# Altium project STM32F4_Mixed-Signal_Interface_Board.PrjPcb
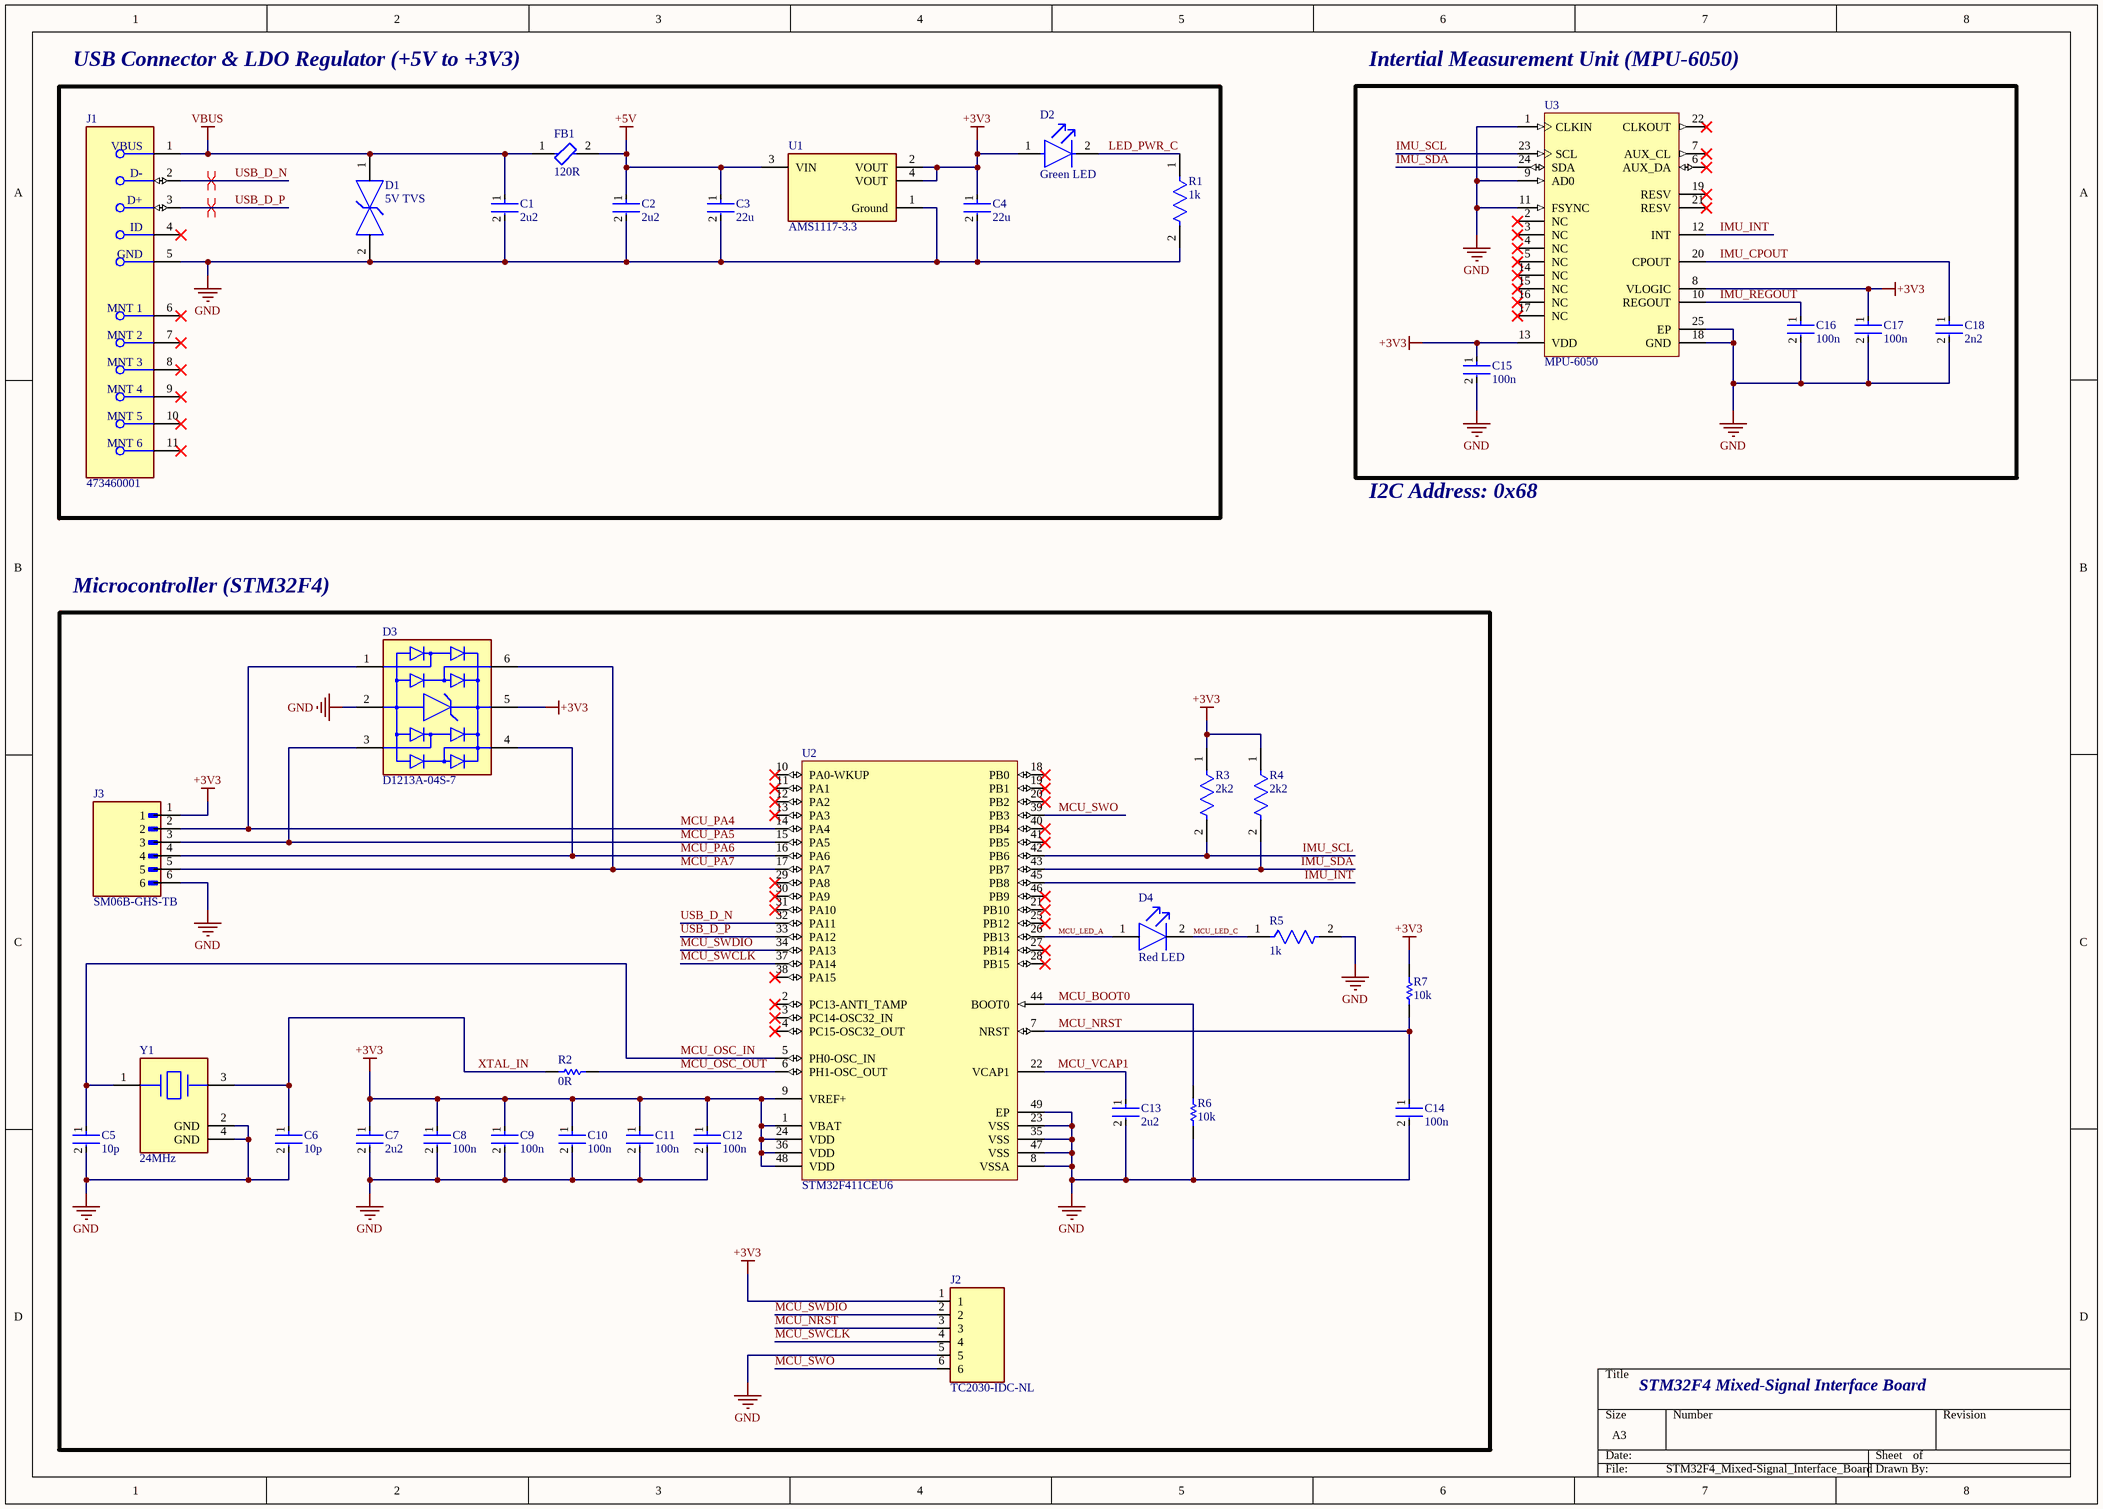
[diagram p0: STM32F4_Mixed-Signal_Interface_Board.SchDoc]
1 sheet, 37 parts. Net scope: global (net labels, ports and power ports of the same name join across sheets).
Board file: STM32F4_Mixed-Signal_Interface_Board_PCB.PcbDoc

## Sheet STM32F4_Mixed-Signal_Interface_Board.SchDoc
size A3; SheetNumber: 1; SheetTotal: 1

### Parts
C1  2u2  [FP-CC0603-DA-MFG]
C2  2u2  [FP-CC0603-DA-MFG]
C3  22u  [FP-0805-L_2_0_0_2-W_1_25-IPC_A]
C4  22u  [FP-0805-L_2_0_0_2-W_1_25-IPC_A]
C5  10p  [FP-C0402-BB-MFG]
C6  10p  [FP-C0402-BB-MFG]
C7  2u2  [FP-CC0603-DA-MFG]
C8  100n  [FP-C0402-BB-MFG]
C9  100n  [FP-C0402-BB-MFG]
C10  100n  [FP-C0402-BB-MFG]
C11  100n  [FP-C0402-BB-MFG]
C12  100n  [FP-C0402-BB-MFG]
C13  2u2  [FP-CC0603-DA-MFG]
C14  100n  [FP-C0402-BB-MFG]
C15  100n  [FP-C0402-BB-MFG]
C16  100n  [FP-C0402-BB-MFG]
C17  100n  [FP-C0402-BB-MFG]
C18  2n2  [FP-C0402-BB-MFG]
D1  5V TVS  [FP-GG0402-MFG]
D2  Green LED  [FP-SM0402GC-MFG]
D3  D1213A-04S-7  [FP-SOT363-MFG]
D4  Red LED  [FP-SM0402RC-MFG]
FB1  120R  [FP-MMZ0603-IPC_A]
J1  473460001  [FP-473460001-MFG]
J2  TC2030-IDC-NL  [TAG_TC2030-IDC-NL]
J3  SM06B-GHS-TB  [JST_SM06B-GHS-TB]
R1  1k  [FP-MCS0402-IPC_C]
R2  0R  [RESC1005X40X20NL05T10]
R3  2k2  [FP-RT0402-MFG]
R4  2k2  [FP-RT0402-MFG]
R5  1k  [FP-MCS0402-IPC_C]
R6  10k  [RESC1005X40X20NL05T10]
R7  10k  [RESC1005X40X20NL05T10]
U1  AMS1117-3.3  [FP-AMS1117-IPC_C]
U2  STM32F411CEU6  [STM-UFQFPN48_L]
U3  MPU-6050  [IS-QFN-24_V]
Y1  24MHz  [FP-ABM11W-MFG]

### Blocks framed on the sheet
USB Connector & LDO Regulator (+5V to +3V3): C1-C4 D1 D2 FB1 J1 R1 U1
Intertial Measurement Unit (MPU-6050): C15-C18 U3
Microcontroller (STM32F4): C5-C14 D3 D4 J2 J3 R2-R7 U2 Y1

### Nets
+3V3: C4.1 C7.1 C8.1 C9.1 C10.1 C11.1 C12.1 C15.1 C17.1 D2.1(A) D3.5(VP) J2.1 J3.1 R3.1 R4.1 R7.2 U1.2(VOUT) U1.4(VOUT) U2.1(VBAT) U2.9(VREF+) U2.24(VDD) U2.36(VDD) U2.48(VDD) U3.8(VLOGIC) U3.13(VDD)
+5V: C2.1 C3.1 FB1.2 U1.3(VIN)
GND: C1.2 C2.2 C3.2 C4.2 C5.2 C6.2 C7.2 C8.2 C9.2 C10.2 C11.2 C12.2 C13.2 C14.2 C15.2 C16.2 C17.2 C18.2 D1.2(IO_2) D3.2(VN) J1.5(GND) J2.5 J3.6 R1.2 R5.2 R6.1 U1.1(Ground) U2.8(VSSA) U2.23(VSS) U2.35(VSS) U2.47(VSS) U2.49(EP) U3.1(CLKIN) U3.9(AD0) U3.11(FSYNC) U3.18(GND) U3.25(EP) Y1.2(GND) Y1.4(GND)
VBUS: C1.1 D1.1(IO_1) FB1.1 J1.1(VBUS)
IMU_CPOUT: C18.1 U3.20(CPOUT)
IMU_INT: U2.45(PB8) U3.12(INT)
IMU_REGOUT: C16.1 U3.10(REGOUT)
IMU_SCL: R3.2 U2.42(PB6) U3.23(SCL)
IMU_SDA: R4.2 U2.43(PB7) U3.24(SDA)
LED_PWR_C: D2.2(C) R1.1
MCU_BOOT0: R6.2 U2.44(BOOT0)
MCU_LED_A: D4.1(A) U2.26(PB13)
MCU_LED_C: D4.2(C) R5.1
MCU_NRST: C14.1 J2.3 R7.1 U2.7(NRST)
MCU_OSC_IN: C5.1 U2.5(PH0-OSC_IN) Y1.1
MCU_OSC_OUT: R2.1 U2.6(PH1-OSC_OUT)
MCU_PA4: D3.1(CH1) J3.2 U2.14(PA4)
MCU_PA5: D3.3(CH2) J3.3 U2.15(PA5)
MCU_PA6: D3.4(CH3) J3.4 U2.16(PA6)
MCU_PA7: D3.6(CH4) J3.5 U2.17(PA7)
MCU_SWCLK: J2.4 U2.37(PA14)
MCU_SWDIO: J2.2 U2.34(PA13)
MCU_SWO: J2.6 U2.39(PB3)
MCU_VCAP1: C13.1 U2.22(VCAP1)
USB_D_N: J1.2(D-) U2.32(PA11)
USB_D_P: J1.3(D+) U2.33(PA12)
XTAL_IN: C6.1 R2.2 Y1.3

Not connected (* = marked no-connect by the designer): J1 4(ID)* 6(MNT_1)* 7(MNT_2)* 8(MNT_3)* 9(MNT_4)* 10(MNT_5)* 11(MNT_6)*; U2 2(PC13-ANTI_TAMP)* 3(PC14-OSC32_IN)* 4(PC15-OSC32_OUT)* 10(PA0-WKUP)* 11(PA1)* 12(PA2)* 13(PA3)* 18(PB0)* 19(PB1)* 20(PB2)* 21(PB10)* 25(PB12)* 27(PB14)* 28(PB15)* 29(PA8)* 30(PA9)* 31(PA10)* 38(PA15)* 40(PB4)* 41(PB5)* 46(PB9)*; U3 2(NC)* 3(NC)* 4(NC)* 5(NC)* 6(AUX_DA)* 7(AUX_CL)* 14(NC)* 15(NC)* 16(NC)* 17(NC)* 19(RESV)* 21(RESV)* 22(CLKOUT)*

### Layout directives
differential pair; net class DIFF_USB: USB_D_N, USB_D_P

### Notes on the sheet
- I2C Address: 0x68
- STM32F4 Mixed-Signal Interface Board

### Library data of the parts
C1 C2 C7 C13 = CMP-03422-000257-1: CAP CER 2.2UF 16V X5R 0603; Manufacturer Part Number: CC0603MRX5R7BB225; Manufacturer: YAGEO; Tolerance: 0.2; Temperature Coefficient: 15%; Material: Ceramic; Mouser Description: Multilayer Ceramic Capacitors MLCC - SMD/SMT 2.2uF 16V 20% Ceramic Capacitor; Temperature Range Low: -55°C; Lead Free: Yes; Device Class L1: Passive Components; Device Class L2: Capacitors; Temperature Characteristic: X5R; Height: 0.9mm; Digikey Description: CAP CER 2.2UF 16V X5R 0603; Package: CC0603-DA; RoHS: TRUE; Capacitance: 2.2 uF; Automotive: No; Value: 2.2 uF; Device Class L3: Ceramic Capacitors; Voltage: 16 V; ComponentLink2URL: http://www.yageo.com/documents/recent/UPY-GPHC_X7R_6.3V-to-50V_18.pdf; Footprint Url: http://www.yageo.com/exep/pages/download/literatures/UPY-C_GEN_24.pdf; Octopart: https://octopart.com/cc0603mrx5r7bb225-yageo-81932636; Temperature Range High: +125°C; Temperature: -55°C to +125°C; Category: Cap; Voltage Rating: 16 V; ComponentLink2Description: Datasheet
C3 C4 = CMP-14477-000140-3: Multilayer Ceramic Capacitor 22uF 16V X5R 20% SMD 0805 T/R; Resistor Type: Ceramic; Packaging: Tape and Reel; Height: 1.25mm; RoHS Compliant: Yes; Case Code (Metric): 2012; Series: M; Dielectric: X5R; Max Operating Temperature: 85°C; Voltage Rating: 16V; Width: 0.039inch; Capacitance: 22uF; Min Operating Temperature: -55°C; Thickness: 0.049inch; Termination: SMD/SMT; Construction: Flat; Voltage Rating (DC): 16V; Package Quantity: 1; Tolerance: 20%; Case Code (Imperial): 0805; Length: 2mm; Mount: Surface Mount; Halogen Free: Halogen Free; Case/Package: 0805
C5 C6 = CMP-03020-017648-1: C0402 10 pF X8R 1.00% 16 V; Manufacturer Part Number: C0402C100F4HACAUTO; Manufacturer: Kemet; Material: Ceramic; Capacitance: 10 pF; Tolerance: 0.01; Voltage Rating: 16 V; Temperature Coefficient: 15%; Value: 10 pF; ComponentLink2URL: https://content.kemet.com/datasheets/KEM_C1002_X7R_SMD.pdf; Lead Free: Yes; Temperature: -55°C to +125°C; ComponentLink2Description: Datasheet; Temperature Range Low: -55°C; Package: C0402-BB; Device Class L3: Ceramic Capacitors; Ipc Land Pattern Name: CAPC10050X50; RoHS: TRUE; Category: Cap; Device Class L1: Passive Components; Device Class L2: Capacitors; Automotive: No; Height: 0.55mm; Temperature Range High: +125°C; Temperature Characteristic: X8R; Octopart: https://octopart.com/c0402c100f4hacauto-kemet-88079165
C8-C12 C14-C18 = CMP-2008-03082-2: CAP CER 0.1UF 16V X7R 0402; Manufacturer Part Number: C0402C104K4RACAUTO; Manufacturer: Kemet; Temperature Coefficient: 15%; Tolerance: 0.1; Capacitance: 0.10 μF; Material: Ceramic; Value: 0.10 μF; Device Class L3: Ceramic Capacitors; Voltage Rating: 16 V; Temperature Range High: +125°C; Device Class L2: Capacitors; Height: 0.55mm; Category: Cap; RoHS: TRUE; Temperature Characteristic: X7R; Octopart: https://octopart.com/c0402c104k4racauto-kemet-17309149; Digikey Description: CAP CER 0.1UF 16V X7R 0402; Device Class L1: Passive Components; Temperature Range Low: -55°C; Mouser Description: Cap Ceramic 0.1uF 16V X7R 10% Pad SMD 0402 125C Automotive T/R; ComponentLink2Description: Datasheet; Automotive: No; Ipc Land Pattern Name: CAPC10050X50; ComponentLink2URL: https://content.kemet.com/datasheets/KEM_C1002_X7R_SMD.pdf; Lead Free: Yes; Temperature: -55°C to +125°C; Package: C0402-BB
D1 = CMP-04587-000001-1: TVS DIODE 5V 12V 0402; Manufacturer Part Number: GG040205100N2P; Manufacturer: AVX Corporation; Number Of Channels: 1; Peak Pulse Current: 16A; Capacitance: 10pF; Direction: Bidirectional; Value: 10pF; Breakdown Voltage: 5.5V; Peak Pulse Power: 96W; Automotive: No; ComponentLink2URL: http://datasheets.avx.com/AVX-GiGuard.pdf; Lead Free: Yes; Device Class L2: TVS Diodes; Temperature: -55°C to +125°C; Category: Diode; Reverse Standoff Voltage: 5V; Octopart: https://octopart.com/gg040205100n2p-avx-81066081; Clamping Voltage: 12V; Ipc Land Pattern Name: DIOC10060X50; Digikey Description: TVS DIODE 5V 12V 0402; Device Class L3: unset; ComponentLink2Description: Datasheet; Temperature Range Low: -55°C; Temperature Range High: +125°C; Device Class L1: Circuit Protection; Height: 0.55mm; Package: GG0402; RoHS: TRUE
D2 = CMP-35283-000001-2: LED GREEN CLEAR 0402 SMD; Lens Size: 1mm; Luminous Intensity: 28.5mcd; Viewing Angle: 130°; Forward Voltage: 1.9V; Test Current: 20mA; Lens Color: Colorless; Lens Style: Flat; Dominant Wavelength: 572nm; Case Code (Metric): 1005; Mount: Surface Mount; Case Code (Imperial): 0402; Length: 1mm; Width: 0.5mm; Case/Package: 0402; Lens Transparency: Clear; Height: 0.71mm; Packaging: Tape and Reel; Color: Green
D3 = CMP-12828-000023-1: TVS DIODE 3.3V 10V SOT363; Min Breakdown Voltage: 6V; ESD Protection: Yes; Direction: Unidirectional; Number of Channels: 4; Capacitance: 1.2pF; Test Current: 1mA; Max Reverse Leakage Current: 1uA; Max Surge Current: 5A; Peak Pulse Current: 1A; Max Power Dissipation: 200mW; Width: 1.35mm; Height: 1mm; Package Quantity: 3000; Lead Free: Lead Free; Max Operating Temperature: 150°C; Termination: SMD/SMT; Case/Package: SOT-363; Clamping Voltage: 10V; Length: 2.15mm; Power Line Protection: Yes; Number of Pins: 6; Polarity: Unidirectional; Packaging: Tape and Reel; Contact Plating: Tin; Number of Bidirectional Channels: 4; Breakdown Voltage: 6V; Leakage Current: 1uA; Working Voltage: 3.3V; REACH SVHC: No SVHC; Reverse Standoff Voltage: 3.3V; Mount: Surface Mount; Depth: 1.3mm; Radiation Hardening: No; Min Operating Temperature: -55°C
D4 = CMP-35283-000003-1: LED RED CLEAR 0402 SMD; Test Current: 20mA; Luminous Intensity: 90mcd; Lens Color: Colorless; Lens Style: Flat; Lens Size: 1mm; Forward Voltage: 2.1V; Viewing Angle: 130°; Dominant Wavelength: 631nm; Width: 0.5mm; Length: 1mm; Packaging: Tape and Reel; Height: 0.71mm; Lens Transparency: Clear; Case Code (Imperial): 0402; Case/Package: 0402; Mount: Surface Mount; Case Code (Metric): 1005; Color: Red
FB1 = CMP-08257-000058-1: Signal Line Ferrite Bead 120Ω @ 100MHz 480mA DCR 220mΩ SMD 0201; DC Resistance (DCR): 220mR; Tolerance: 25%; Number of Lines: 1; Case Code (Metric): 0603; Termination: SMD/SMT; Case/Package: 0201; Max Current Rating: 480mA; Max DC Current: 480mA; Max Operating Temperature: 125°C; Weight: 6E-06oz; Impedance: 120R; Height: 0.013inch; Length: 0.024inch; Package Quantity: 15000; RoHS Compliant: Yes; Case Code (Imperial): 0201; Width: 0.012inch; Mount: Surface Mount; Packaging: Tape and Reel; Min Operating Temperature: -55°C
J1 = CMP-2000-05246-2: CONN RCPT USB2.0 MICRO B SMD R/A; Manufacturer: Molex; Conn Orientation: Right Angle; Is Female: yes; Shielding: true; Pitch: 0.65mm; Number Of Contacts: 5; Voltage Rating: 30V; Current Rating: 1.8A; Device Class L2: USB Connectors; Digikey Description: CONN RCPT USB2.0 MICRO B SMD R/A; Height: 2.945mm; RoHS: TRUE; ComponentLink2Description: Datasheet; Octopart: https://octopart.com/47346-0001-molex-7164928; Automotive: No; Package: 0; Category: Conn; Device Class L1: Connectors; Usb Standard: USB 2.0; Temperature: -30°C to +85°C; Temperature Range Low: -30°C; Footprint Url: https://www.molex.com/pdm_docs/sd/473460001_sd.pdf; ComponentLink2URL: https://www.molex.com/webdocs/datasheets/pdf/en-us/0473460001_IO_CONNECTORS.pdf; Lead Free: Yes; Manufacturer Part Number: 473460001; Contact Material: Gold,Nickel; Temperature Range High: +85°C; Device Class L3: unset
J2 = CMP-003-000000-1: CABLE ADAPTER 6 POS; Value: *; Component Type: Standard; Package: None; Source: TC2030-IDC-NL.SchLib; Pin Count: 6; Availability: Unavailable; Price: None; MP: TC2030-IDC-NL; Design Item ID: TC2030-IDC-NL
J3 = CMP-002-00071-1: Connector Header Surface Mount, Right Angle 6 position 0.049 (1.25mm); MF: JST Sales; SnapEDA_Link: https://www.snapeda.com/parts/SM06B-GHS-TB/JST/view-part/?ref=snap; Pins: 6; Design Item ID: SM06B-GHS-TB; Check_prices: https://www.snapeda.com/parts/SM06B-GHS-TB/JST/view-part/?ref=eda; Source: SM06B-GHS-TB.SchLib; Case/Package: None; Value: *; Component Type: Standard; MP: SM06B-GHS-TB
R1 R5 = CMP-2002-02445-2: RES SMD 1.2K OHM 1% 1/10W 0402; Resistance: 1kR; Tolerance: 0.1%; Max Power Dissipation: 63mW; Temperature Coefficient: 25ppm/°C; Max Operating Temperature: 125°C; Min Operating Temperature: -55°C; Case/Package: 0402; Packaging: Tape and Reel; Width: 0.02inch; Lead Free: Lead Free; Number of Terminations: 2; Height: 0.015inch; Package Quantity: 10000; Length: 0.039inch; Composition: Thin Film; Contact Plating: Tin; Depth: 0.5mm; Military Standard: Not
R2 R6 R7 = CMP-2002-01682-1: Manufacturer: Vishay BCcomponents; Part Number: TNPW040210K0DEED
R3 R4 = CMP-03412-027179-1: RES SMD 2.2K OHM 0.1% 1/16W 0402; Manufacturer Part Number: RT0402BRB072K2L; Manufacturer: Yageo; Resistance: 2.2KΩ; Temperature Coefficient: 10 ppm/°C; Value: 2.2KΩ; Tolerance: 0.001; Voltage Rating: 50V; Power Rating: 0.063W; Device Class L1: Passive Components; Composition: Thin Film; Automotive: No; Device Class L3: Chip SMD Resistors; Package: RT0402; Temperature: -55°C to +155°C; ComponentLink2Description: Datasheet; Ipc Land Pattern Name: RESC10050X30; Category: Res; ComponentLink2URL: http://www.yageo.com/documents/recent/PYu-RT_1-to-0.01_RoHS_L_9.pdf; Series: RT; Device Class L2: Resistors; Footprint Url: http://www.yageo.com/exep/pages/download/literatures/PYu-R_Mount_10.pdf; Lead Free: Yes; Octopart: https://octopart.com/rt0402brb072k2l-yageo-71392561; Temperature Range Low: -55°C; RoHS: TRUE; Height: 0.35mm; Digikey Description: RES SMD 2.2K OHM 0.1% 1/16W 0402; Temperature Range High: +155°C
U1 = CMP-209535-000001-1: LDO Voltage Regulators 1A, 3.3V; Manufacturer: Advanced Monolithic Systems; Dropout Voltage: 1.1V; Output Type: Fixed; Nominal Supply Current: 5mA; Max Power Dissipation: 1.2W; Max Supply Voltage: 15V; Number Of Outputs: 1; Standoff Height: 0.64mm; Max Junction Temp: +125°C; Height: 1.8mm; Package: AMS1117; Device Class L2: Power Management ICs; ComponentLink2Description: Datasheet; ComponentLink2URL: http://www.advanced-monolithic.com/pdf/ds1117.pdf; Category: IC; RoHS: TRUE; Automotive: No; Device Class L1: Integrated Circuits (ICs); Output Current: 1A; Device Class L3: Voltage Regulators - Linear; Temperature: -40°C to +125°C; Output Voltage: 3.3V; Manufacturer Part Number: AMS1117-3.3; Temperature Range Low: -40°C; Octopart: https://octopart.com/ams1117-3.3-advanced+monolithic+systems-25899300; Lead Free: Yes; Ipc Land Pattern Name: SOT229P700X180-4; Temperature Range High: +125°C
U2 = CMP-0243-00165-1: ARM Cortex-M4 32-bit MCU+FPU, 512 KB Flash, 128 KB RAM, 36 I/Os, 48-Pin UFQFPN, -40 to 85 degC, Tray; Operating Frequency(F) (Processor speed) (MHz): 100; FLASH Size (Prog) (kB): 512; Internal RAM Size (kB): 128; I/Os (High Current): 36; Supply Voltage(Vcc) min (V): 1.7; Package Reference: 48-Pin Ultra Thin Fine Pitch Quad Flat No-Lead, 7 x 7 x 0.6 mm Body, 0.5 mm Pitch, Exposed Pad; ComponentLink1Description: Manufacturer URL; ComponentLink1URL: http://www.st.com/; Packing: Tray; Package Description: UFQFPN48; Core: ARM Cortex-M4; ComponentLink2Description: Datasheet; ComponentLink2URL: http://www.st.com/st-web-ui/static/active/en/resource/technical/document/datasheet/DM00115249.pdf; DatasheetVersion: Rev. 6; Mounting Technology: Surface Mount
U3 = CMP-1753-00002-2: 3-Axis Gyroscope, Accelerometer and a Digital Motion Processor(TM) (DMP), 2.375 to 3.46 V, -40 to 85 degC, 24-Pin QFN, RoHS, Tape and Reel; Manufacturer: InvenSense; Featured Product: MPU-60506-Axis,IntegratedI²CSolution; Other Names: 1428-1007-2 / MPU6050; Sensor Type: MotionTracking; Online Catalog: MPU-6000™Series; Unit PriceUSD: Digital; Datasheet Version: Rev. 3.3, 05/2012; Category: Sensors,Transducers; Datasheet URL: http://datasheet.octopart.com/MPU-6050-InvenSense-datasheet-14421344.pdf; Family: Multifunction; Standard Package: 5,000; Manufacturer URL: http://www.invensense.com/; Output Type: Digital; Dynamic Catalog: MPU-6000™Series
Y1 = CMP-27762-009014-1: Crystal 24MHz ±10ppm 7pF SMD-4 2mm x 1.6mm; RoHS Compliant: Yes